# Altium schematic sheet xcomm.SchDoc
size A4
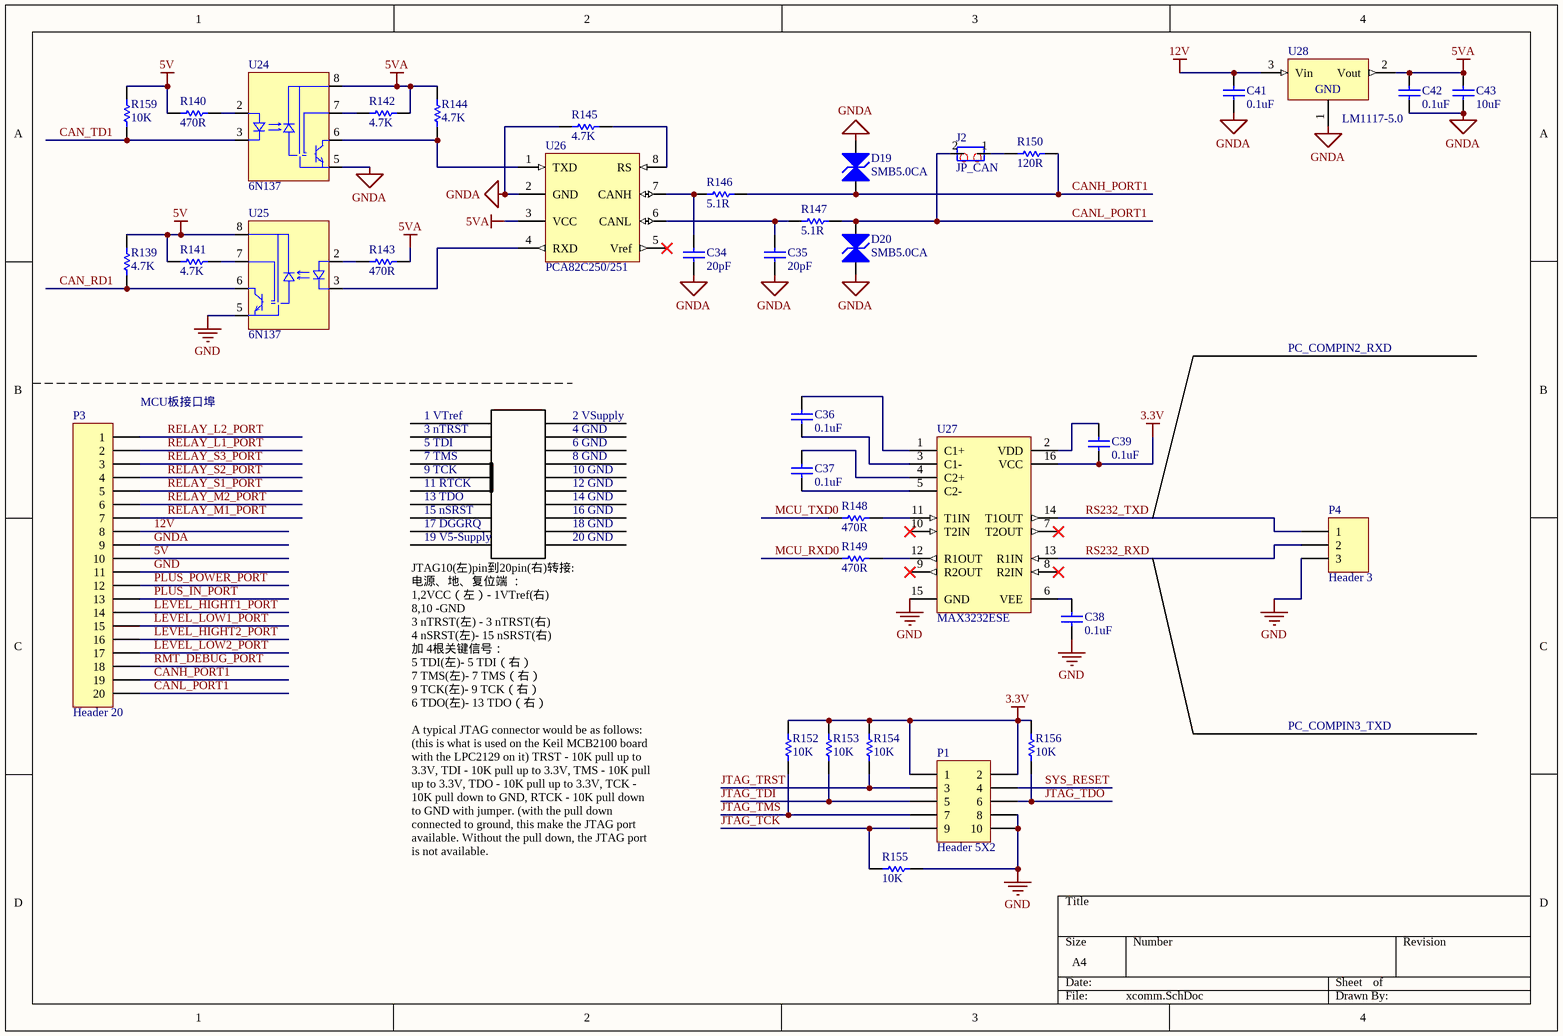
[diagram p0: xcomm.SchDoc]

## Parts
C34  20pF  [CAPC2012M]
C35  20pF  [CAPC2012M]
C36  0.1uF  [CAPC2012M]
C37  0.1uF  [CAPC2012M]
C38  0.1uF  [CAPC2012M]
C39  0.1uF  [CAPC2012M]
C41  0.1uF  [CAPC2012M]
C42  0.1uF  [CAPC2012M]
C43  10uF  [CAPC2012M]
D19  SMB5.0CA  [SMB]
D20  SMB5.0CA  [SMB]
J2  JP_CAN  [DS-01]
P1  Header 5X2  [HDR2X5M]
P3  Header 20  [HDR1X20-2.5]
P4  Header 3  [HDR1X3-2.5]
R139  4.7K  [RESC2012M]
R140  470R  [RESC2012M]
R141  4.7K  [RESC2012M]
R142  4.7K  [RESC2012M]
R143  470R  [RESC2012M]
R144  4.7K  [RESC2012M]
R145  4.7K  [RESC2012M]
R146  5.1R  [RESC2012M]
R147  5.1R  [RESC2012M]
R148  470R  [RESC2012M]
R149  470R  [RESC2012M]
R150  120R  [RESC2012M]
R152  10K  [RESC2012M]
R153  10K  [RESC2012M]
R154  10K  [RESC2012M]
R155  10K  [RESC2012M]
R156  10K  [RESC2012M]
R159  10K  [RESC2012M]
U24  6N137  [SO-8LA]
U25  6N137  [SO-8LA]
U26  PCA82C250/251  [SO8]
U27  MAX3232ESE  [NSO16_N]
U28  LM1117-5.0  [SOT-223]

## Nets
3.3V: C39.2 P1.1 P1.2 R152.2 R153.2 R154.2 R156.2 U27.16(VCC)
5V: P3.10 R139.1 R140.2 R141.1 R159.1 U25.8(VCC)
5VA: C42.2 C43.2 R142.1 R143.2 R144.1 U24.8(VCC) U26.3(VCC) U28.2(Vout)
12V: C41.2 P3.8 U28.3(Vin)
GND: C38.1 P1.8 P1.10 P3.11 P4.3 R155.2 U25.5(GND) U27.15(GND)
GNDA: C34.1 C35.1 C41.1 C42.1 C43.1 D19.1(A) D20.1(A) P3.9 R145.1 U24.5(GND) U26.2(GND) U28.1(GND)
CAN_RD1: R139.2 U25.6(Vo)
CAN_TD1: R159.2 U24.3(K)
CANH_PORT1: D19.2(K) P3.19 R146.1 R150.2
CANL_PORT1: D20.2(K) J2.2 P3.20 R147.1
JTAG_TCK: P1.9 R155.1
JTAG_TDI: P1.5 R153.1
JTAG_TDO: P1.6 R156.1
JTAG_TMS: P1.7 R152.1
JTAG_TRST: P1.3 R154.1
LEVEL_HIGHT1_PORT: P3.14
LEVEL_HIGHT2_PORT: P3.16
LEVEL_LOW1_PORT: P3.15
LEVEL_LOW2_PORT: P3.17
MCU_RXD0: R149.1
MCU_TXD0: R148.1
PLUS_IN_PORT: P3.13
PLUS_POWER_PORT: P3.12
RELAY_L1_PORT: P3.2
RELAY_L2_PORT: P3.1
RELAY_M1_PORT: P3.7
RELAY_M2_PORT: P3.6
RELAY_S1_PORT: P3.5
RELAY_S2_PORT: P3.4
RELAY_S3_PORT: P3.3
RMT_DEBUG_PORT: P3.18
RS232_RXD: P4.2 U27.13(R1IN)
RS232_TXD: P4.1 U27.14(T1OUT)
SYS_RESET: P1.4
NetC34_2: C34.2 R146.2 U26.7(CANH)
NetC35_2: C35.2 R147.2 U26.6(CANL)
NetC36_1: C36.1 U27.3(C1-)
NetC36_2: C36.2 U27.1(C1+)
NetC37_1: C37.1 U27.5(C2-)
NetC37_2: C37.2 U27.4(C2+)
NetC38_2: C38.2 U27.6(VEE)
NetC39_1: C39.1 U27.2(VDD)
NetJ2_1: J2.1 R150.1
NetR140_1: R140.1 U24.2(A)
NetR141_2: R141.2 U25.7(Ve)
NetR142_2: R142.2 U24.7(Ve)
NetR143_1: R143.1 U25.2(A)
NetR144_2: R144.2 U24.6(Vo) U26.1(TXD)
NetR145_2: R145.2 U26.8(RS)
NetR148_2: R148.2 U27.11(T1IN)
NetR149_2: R149.2 U27.12(R1OUT)
NetU25_3: U25.3(K) U26.4(RXD)

Not connected (* = marked no-connect by the designer): U26 5(Vref)*; U27 7(T2OUT)* 8(R2IN)* 9(R2OUT)* 10(T2IN)*

## Notes on the sheet
- PC_COMPIN2_RXD
- (near P3) MCU板接口埠
- 1 VTref
- 3 nTRST
- 5 TDI
- 2 VSupply
- 4 GND
- 6 GND
- 7 TMS
- 9 TCK
- 11 RTCK
- 13 TDO
- 15 nSRST
- 8 GND
- 10 GND
- 12 GND
- 14 GND
- 16 GND
- 17 DGGRQ
- 19 V5-Supply
- 18 GND
- 20 GND
- JTAG10(左)pin到20pin(右)转接:
  电源、地、复位端 ：
  1,2VCC（左）- 1VTref(右)
  8,10 -GND
  3 nTRST(左) - 3 nTRST(右)
  4 nSRST(左)- 15 nSRST(右)
  加 4根关键信号：
  5 TDI(左)- 5 TDI（右）
  7 TMS(左)- 7 TMS（右）
  9 TCK(左)- 9 TCK（右）
  6 TDO(左)- 13 TDO（右）
- PC_COMPIN3_TXD
- A typical JTAG connector would be as follows: (this is what is used on the Keil MCB2100 board with the LPC2129 on it) TRST - 10K pull up to 3.3V, TDI - 10K pull up to 3.3V, TMS - 10K pull up to 3.3V, TDO - 10K pull up to 3.3V, TCK - 10K pull down to GND, RTCK - 10K pull down to GND with jumper. (with the pull down connected to ground, this make the JTAG port available. Without the pull down, the JTAG port is not available.

## Library data of the parts
C34-C39 C41-C43 = Cap: Capacitor; Value: 1nF; Published: 8-Jun-2000; LatestRevisionDate: 17-Jul-2002; LatestRevisionNote: Re-released for DXP Platform.; PackageReference: RAD-0.3; Publisher: Altium Limited
D19 D20 = Bi-dir TVS Diode: Published: 8-Jun-2000; LatestRevisionDate: 17-Jul-2002; LatestRevisionNote: Re-released for DXP Platform.; PackageReference: DIODE-0.7; Publisher: Altium Limited
J2 = JK2H: 'Dial Switch pitch 7.62mm
P1 = Header 5X2: Header, 5-Pin, Dual row,Pitch 2mm; LatestRevisionDate: 17-Jul-2002; LatestRevisionNote: Re-released for DXP Platform.; Publisher: Altium Limited
P3 = Header 20: 'Wafer Header, 20-Pin,white; LatestRevisionDate: 17-Jul-2002; LatestRevisionNote: Re-released for DXP Platform.; Publisher: Altium Limited
P4 = Header 3: 'Wafer Header, 3-Pin,white; LatestRevisionDate: 17-Jul-2002; LatestRevisionNote: Re-released for DXP Platform.; Publisher: Altium Limited
R139-R150 = Res1: Resistor; Value: 10K; Published: 8-Jun-2000; LatestRevisionDate: 17-Jul-2002; LatestRevisionNote: Re-released for DXP Platform.; PackageReference: AXIAL-0.3; Publisher: Altium Limited
R152-R156 R159 = Res1: Resistor; Published: 8-Jun-2000; LatestRevisionDate: 17-Jul-2002; LatestRevisionNote: Re-released for DXP Platform.; PackageReference: AXIAL-0.3; Publisher: Altium Limited; Value: 10K
U24 U25 = HCPL-2601/2611: Hight Speed 10Mbit/s Logic Gate Optocoupler
U26 = PCA82C250/251: CAN controller bus transceiver
U27 = MAX232ESE: +5V Powered, Multi-Channel RS-232 Driver/Receiver; Published: 16-Jan-2001; LatestRevisionDate: 13-Apr-2006; LatestRevisionNote: IPC-7351 Footprint Added.; PackageReference: NSO16; Publisher: Altium Limited; PackageDescription: 16-Pin Small Outline Integrated Circuit 1.27 mm Pitch; Code_JEDEC: MS-012-AC; Code_IPC: SOIC127P600-16; ComponentLink1Description: Manufacturer Link; ComponentLink1URL: http://www.maxim-ic.com/; ComponentLink2Description: Datasheet; ComponentLink2URL: http://pdfserv.maxim-ic.com/en/ds/MAX220-MAX249.pdf
U28 = LM1117T-5.0: 800mA Low-Dropout Linear Regulator